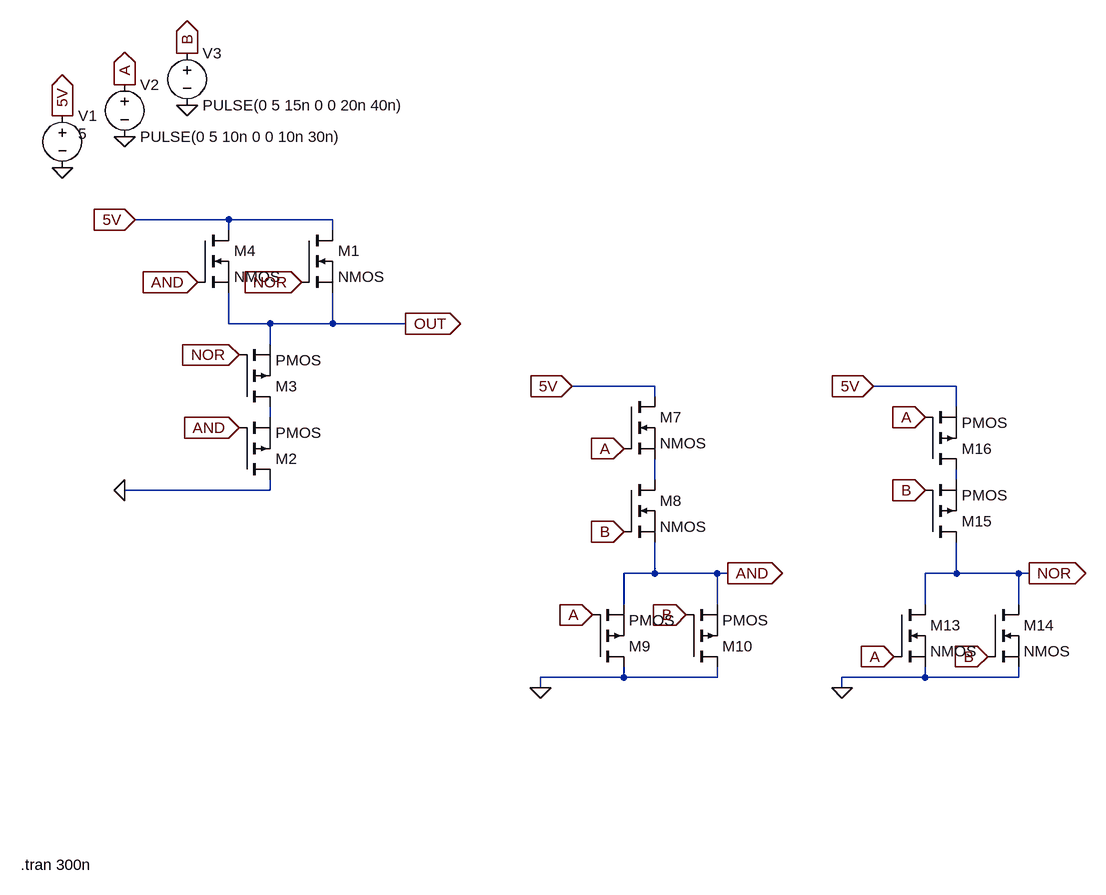
[diagram p0: schematic NOR_AND.asc]
NOR_AND.asc, the LTspice schematic file:
Version 4.1
SHEET 1 1924 1396
WIRE 240 192 96 192
WIRE 400 192 240 192
WIRE 240 208 240 192
WIRE 400 208 400 192
WIRE 240 352 240 304
WIRE 304 352 240 352
WIRE 400 352 400 304
WIRE 400 352 304 352
WIRE 512 352 400 352
WIRE 304 384 304 352
WIRE 896 448 768 448
WIRE 1360 448 1232 448
WIRE 896 464 896 448
WIRE 1360 480 1360 448
WIRE 304 496 304 480
WIRE 896 592 896 560
WIRE 1360 592 1360 576
WIRE 304 608 304 592
WIRE 304 608 80 608
WIRE 896 736 896 688
WIRE 896 736 848 736
WIRE 992 736 896 736
WIRE 1008 736 992 736
WIRE 1360 736 1360 688
WIRE 1360 736 1312 736
WIRE 1456 736 1360 736
WIRE 1472 736 1456 736
WIRE 848 784 848 736
WIRE 992 784 992 736
WIRE 1312 784 1312 736
WIRE 1456 784 1456 736
WIRE 848 896 848 880
WIRE 848 896 720 896
WIRE 992 896 992 880
WIRE 992 896 848 896
WIRE 1312 896 1312 880
WIRE 1312 896 1184 896
WIRE 1456 896 1456 880
WIRE 1456 896 1312 896
WIRE 720 912 720 896
WIRE 1184 912 1184 896
FLAG -16 32 5V
IOPIN -16 32 Out
FLAG 80 -16 A
IOPIN 80 -16 Out
FLAG 176 -64 B
IOPIN 176 -64 Out
FLAG 176 16 0
FLAG 80 64 0
FLAG -16 112 0
FLAG 96 192 5V
IOPIN 96 192 In
FLAG 80 608 0
FLAG 768 448 5V
IOPIN 768 448 In
FLAG 720 912 0
FLAG 848 544 A
IOPIN 848 544 In
FLAG 944 800 B
IOPIN 944 800 In
FLAG 800 800 A
IOPIN 800 800 In
FLAG 848 672 B
IOPIN 848 672 In
FLAG 512 352 OUT
IOPIN 512 352 Out
FLAG 1008 736 AND
IOPIN 1008 736 Out
FLAG 192 288 AND
IOPIN 192 288 In
FLAG 256 512 AND
IOPIN 256 512 In
FLAG 256 400 NOR
IOPIN 256 400 In
FLAG 352 288 NOR
IOPIN 352 288 In
FLAG 1232 448 5V
IOPIN 1232 448 In
FLAG 1184 912 0
FLAG 1312 496 A
IOPIN 1312 496 In
FLAG 1408 864 B
IOPIN 1408 864 In
FLAG 1264 864 A
IOPIN 1264 864 In
FLAG 1312 608 B
IOPIN 1312 608 In
FLAG 1472 736 NOR
IOPIN 1472 736 Out
SYMBOL voltage -16 16 R0
WINDOW 3 24 44 Left 2
WINDOW 123 0 0 Left 0
WINDOW 39 0 0 Left 0
SYMATTR InstName V1
SYMATTR Value 5
SYMBOL voltage 80 -32 R0
WINDOW 123 0 0 Left 0
WINDOW 39 0 0 Left 0
SYMATTR InstName V2
SYMATTR Value PULSE(0 5 10n 0 0 10n 30n)
SYMBOL voltage 176 -80 R0
WINDOW 123 0 0 Left 0
WINDOW 39 0 0 Left 0
SYMATTR InstName V3
SYMATTR Value PULSE(0 5 15n 0 0 20n 40n)
SYMBOL pmos 256 592 M180
SYMATTR InstName M2
SYMBOL nmos 192 208 R0
SYMATTR InstName M4
SYMBOL nmos 352 208 R0
SYMATTR InstName M1
SYMBOL nmos 848 464 R0
SYMATTR InstName M7
SYMBOL nmos 848 592 R0
SYMATTR InstName M8
SYMBOL pmos 800 880 M180
SYMATTR InstName M9
SYMBOL pmos 944 880 M180
SYMATTR InstName M10
SYMBOL pmos 256 480 M180
SYMATTR InstName M3
SYMBOL nmos 1264 784 R0
SYMATTR InstName M13
SYMBOL nmos 1408 784 R0
SYMATTR InstName M14
SYMBOL pmos 1312 688 M180
SYMATTR InstName M15
SYMBOL pmos 1312 576 M180
SYMATTR InstName M16
TEXT -80 1184 Left 2 !.tran 300n

The netlist it stands for:
* NOR_AND.asc
V1 5V 0 5
V2 A 0 PULSE(0 5 10n 0 0 10n 30n)
V3 B 0 PULSE(0 5 15n 0 0 20n 40n)
M2 0 AND N001 N001 PMOS
M4 5V AND OUT OUT NMOS
M1 5V NOR OUT OUT NMOS
M7 5V A N002 N002 NMOS
M8 N002 B AND AND NMOS
M9 0 A AND AND PMOS
M10 0 B AND AND PMOS
M3 N001 NOR OUT OUT PMOS
M13 NOR A 0 0 NMOS
M14 NOR B 0 0 NMOS
M15 NOR B N003 N003 PMOS
M16 N003 A 5V 5V PMOS
.model NMOS NMOS
.model PMOS PMOS
.lib standard.mos
.tran 300n
.backanno
.end